# EAGLE design VGABoard (EAGLE 6.4)
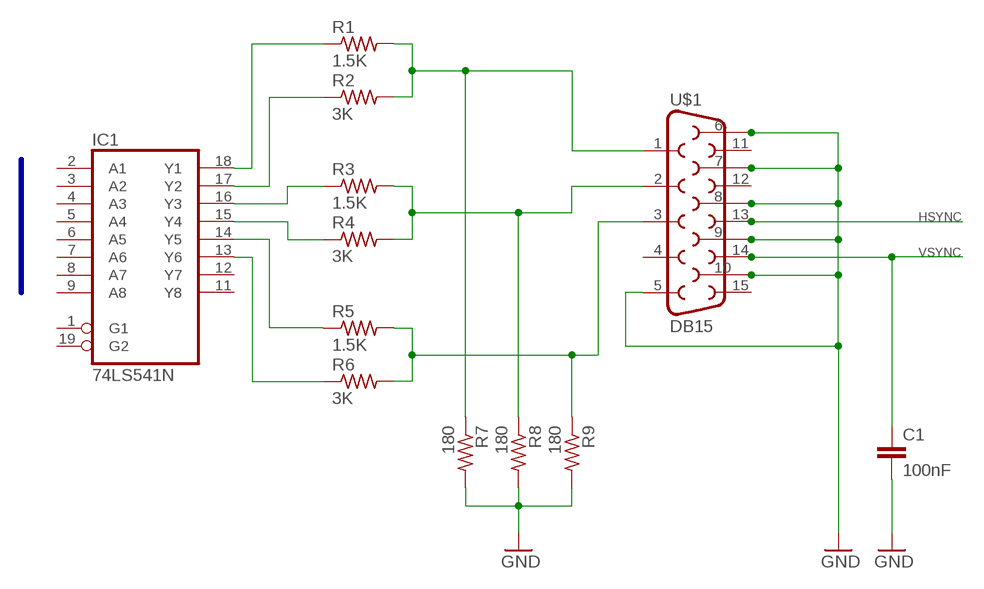
[diagram p0: schematic, sheet 1]

## Parts
C1  100nF  CAPEZ  [CAP-PTH-SMALLEZ]
IC1  74LS541N  [DIL20]
R1  1.5K  R-US_0204/5  [0204/5]
R2  3K  R-US_0204/5  [0204/5]
R3  1.5K  R-US_0204/5  [0204/5]
R4  3K  R-US_0204/5  [0204/5]
R5  1.5K  R-US_0204/5  [0204/5]
R6  3K  R-US_0204/5  [0204/5]
R7  180  R-US_0204/5  [0204/5]
R8  180  R-US_0204/5  [0204/5]
R9  180  R-US_0204/5  [0204/5]
U$1  DB15  [DB15]

## Nets
GND: C1.2 R7.2 R8.2 R9.2 U$1.5 U$1.6 U$1.7 U$1.8 U$1.9 U$1.10
HSYNC: U$1.13
N$1: IC1.18(Y1) R1.1
N$2: IC1.17(Y2) R2.1
N$3: IC1.16(Y3) R3.1
N$4: IC1.15(Y4) R4.1
N$5: IC1.13(Y6) R6.1
N$6: IC1.14(Y5) R5.1
N$7: R1.2 R2.2 R7.1 U$1.1
N$8: R3.2 R4.2 R8.1 U$1.2
N$9: R5.2 R6.2 R9.1 U$1.3
VSYNC: C1.1 U$1.14
Unconnected: IC1.1(G1) IC1.2(A1) IC1.3(A2) IC1.4(A3) IC1.5(A4) IC1.6(A5) IC1.7(A6) IC1.8(A7) IC1.9(A8) IC1.11(Y8) IC1.12(Y7) IC1.19(G2) U$1.4 U$1.11 U$1.12 U$1.15

## Buses
VDATA[0..7]

## Power pins joined to a net without a drawn wire
GND: IC1.10(GND)
VCC: IC1.20(VCC)

## Library data of the parts
C1 = SparkFun-Capacitors:CAP: Capacitor Standard 0603 ceramic capacitor, and 0.1" leaded capacitor.
IC1 = 74xx-us:74*541: Octal BUFFER and LINE DRIVER, 3-state
R1-R9 = resistor:R-US_: RESISTOR, American symbol
U$1 = SparkFun-Connectors:DB15: DB15 / VGA right angle through-hole female connector.

## Board
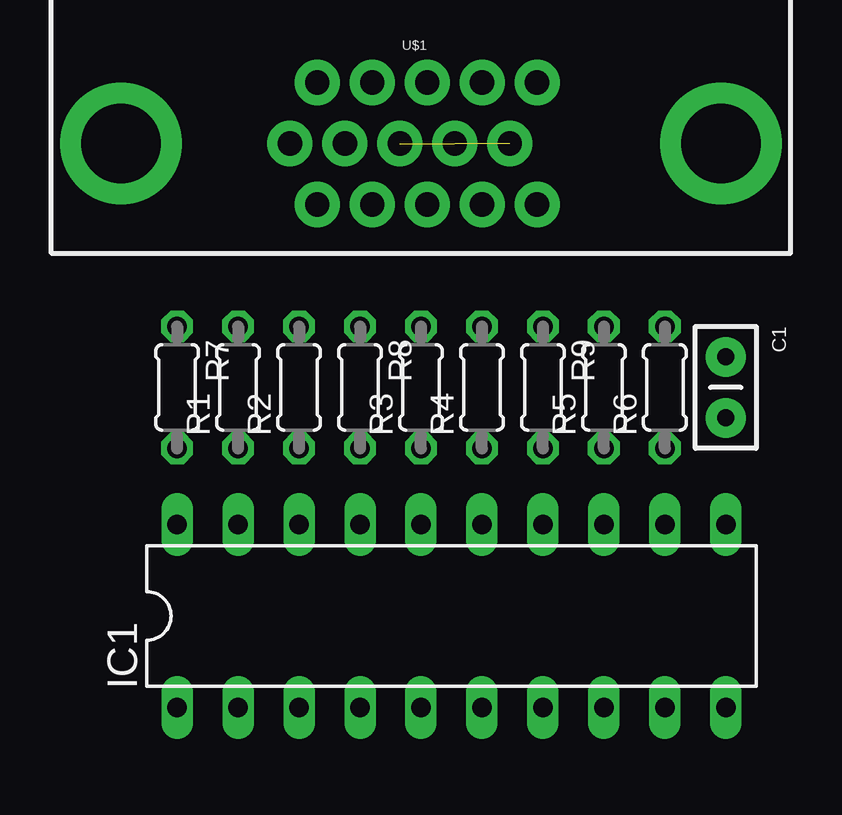
[diagram p1: board, top side]
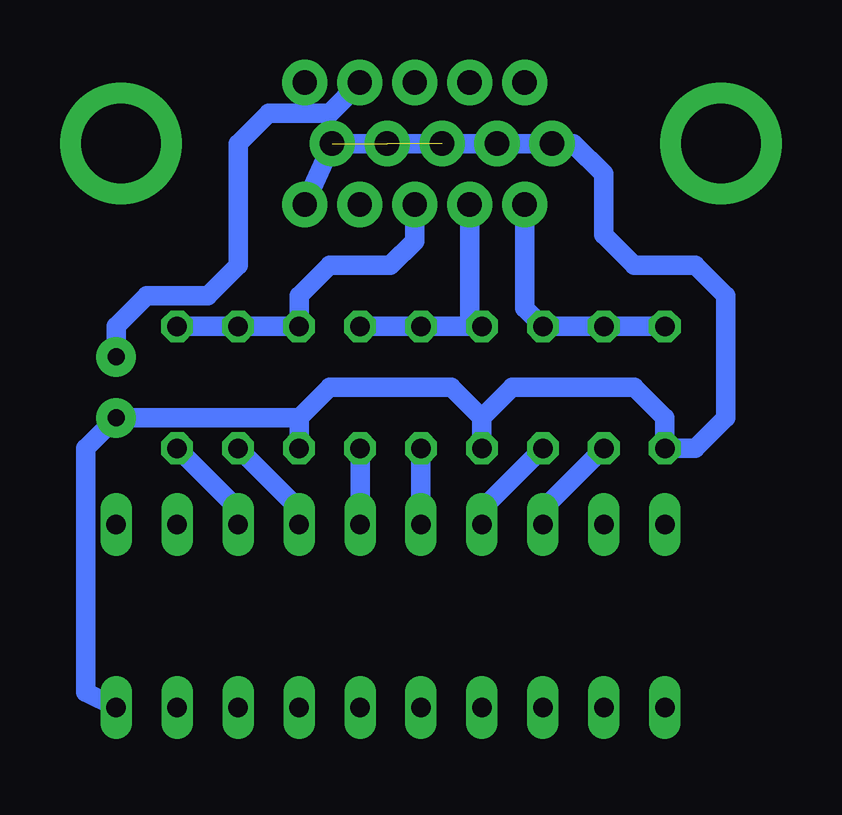
[diagram p2: board, bottom side, seen from below]

No outline drawn. Coordinates in mm, seen from the top.
Copper layers (1*16): Top 0.035mm / dielectric 1.5mm / Bottom 0.035mm
Design rules "default": minimum track width 10mil, minimum drill 24mil, track to track 8mil, track to pad 8mil, pad to pad 8mil, via to via 8mil, smd to smd 8mil, copper to edge 40mil, drill to drill 8mil, minimum pad ring 10mil, minimum via ring 8mil, stop-mask expansion 4mil, vias tented up to drill 0mil, thermal gap 10mil

### Footprints (pad centres in the part's own frame; a part is rotated, then mirrored left to right if it is on the bottom)
CAP-PTH-SMALLEZ = drill 0.7 pad 1.651: 1 0,0; 2 2.54,0
DIL20 = drill 0.813 long: 1 -11.43,-3.81; 2 -8.89,-3.81; 3 -6.35,-3.81; 4 -3.81,-3.81; 5 -1.27,-3.81; 6 1.27,-3.81; 7 3.81,-3.81; 8 6.35,-3.81; 9 8.89,-3.81; 10 11.43,-3.81; 11 11.43,3.81; 12 8.89,3.81; 13 6.35,3.81; 14 3.81,3.81; 15 1.27,3.81; 16 -1.27,3.81; 17 -3.81,3.81; 18 -6.35,3.81; 19 -8.89,3.81; 20 -11.43,3.81
0204/5 = drill 0.813 octagon: 1 -2.54,0; 2 2.54,0
DB15 = drill 1.016 pad 1.88: 1 -4.32,-7.62; 2 -2.03,-7.62; 3 0.26,-7.62; 4 2.55,-7.62; 5 4.84,-7.62; 6 -5.46,-5.08; 7 -3.17,-5.08; 8 -0.88,-5.08; 9 1.41,-5.08; 10 3.7,-5.08; 11 -4.32,-2.54; 12 -2.03,-2.54; 13 0.26,-2.54; 14 2.55,-2.54; 15 4.84,-2.54 | drill 3.302 pad 5.08: G1 -12.5,-5.08; G2 12.5,-5.08

### Placement (x,y rotation side)
C1  31.75,26.67 270 top
IC1  20.32,15.88 0 top
R1  11.43,25.4 90 top
R2  13.97,25.4 90 top
R3  19.05,25.4 90 top
R4  21.59,25.4 90 top
R5  26.67,25.4 90 top
R6  29.21,25.4 90 top
R7  8.89,25.4 270 top
R8  16.51,25.4 270 top
R9  24.13,25.4 270 top
U$1  19.05,40.64 0 top

### Tracks (layer width: path | path; a pad name or v marks a point on that pad's centre or on a via)
GND  (2 unrouted)
  Bottom 0.813: 16.51,24.13 15.24,25.4 10.16,25.4 8.89,24.13 R7.2 7.62,22.86 6.35,24.13 6.35,29.21 7.62,30.48 10.16,30.48 11.43,31.75 11.43,34.29 12.7,35.56 U$1.7 | 16.51,24.13 R8.2 | R9.2 24.13,24.13 | 24.13,24.13 22.86,25.4 17.78,25.4 16.51,24.13 | U$1.6 U$1.7 | U$1.7 U$1.10 U$1.5 | 24.13,24.13 C1.2 33.02,22.86 33.02,12.7 IC1.10
N$1
  Bottom 0.813: R1.1 13.97,20.32 IC1.18
N$2
  Bottom 0.813: R2.1 16.51,20.32 IC1.17
N$3
  Bottom 0.813: R3.1 IC1.16
N$4
  Bottom 0.813: R4.1 IC1.15
N$5
  Bottom 0.813: R6.1 26.67,20.32 IC1.13
N$6
  Bottom 0.813: R5.1 24.13,20.32 IC1.14
N$7
  Bottom 0.813: R2.2 R1.2 | R2.2 R7.1 | U$1.1 14.73,28.7 R2.2
N$8
  Bottom 0.813: R4.2 R3.2 R8.1 17.02,28.45 U$1.2
N$9
  Bottom 0.813: R6.2 R5.2 R9.1 24.13,29.21 22.86,30.48 20.32,30.48 19.31,31.49 U$1.3
VSYNC
  Bottom 0.813: U$1.14 22.86,36.83 25.4,36.83 26.67,35.56 26.67,30.48 27.94,29.21 30.48,29.21 31.75,27.94 C1.1